# Altium project LESSON-EXAMPLE.PrjPcb
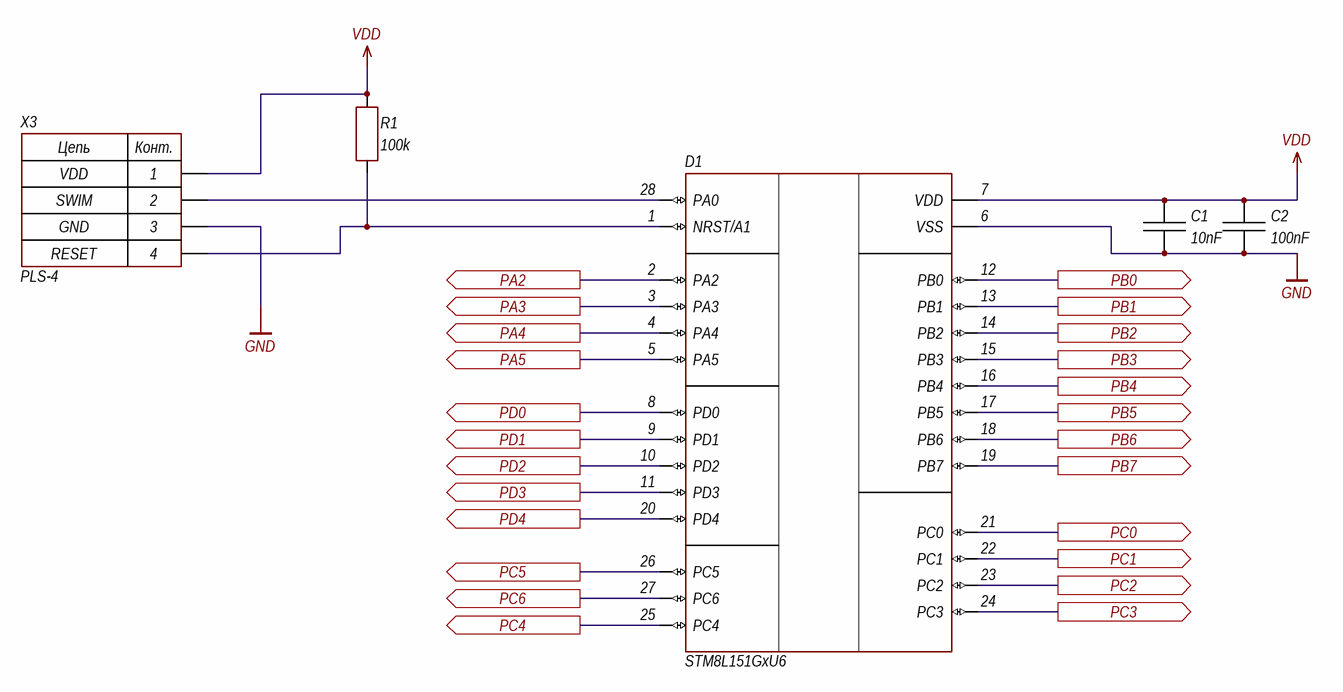
[diagram p0: MainPage.SchDoc]
ProjectVersion: 0.1.2; ProjectNumber: LESSON-EXAMPLE; ProjectDescription2Line: Main board; ProjectDescription: Example project demo; ProjectDateShort: 2021.10; ProjectDate: 23.10.2021; ProjectCompanyName: Azek Clark © 2021; ProjectBoardType: MAINB; ProjectAuthor: Clark A.
2 sheets, 10 parts. Net scope: flat (ports and power ports of the same name join across sheets).
Board file: PCB.PcbDoc
Sheets:
  MainPage.SchDoc
  Connectors.SchDoc

## Sheet MainPage.SchDoc: =ProjectDescription
size 420 x 297 mm; Author: Clark A.; CompanyName: Azek Clark © 2021; Address1: Address1; Address2: Address2; Address3: Address3; Address4: Address4; DocumentNumber: LESSON-EXAMPLE-0.1.2-MAINB Э3; SheetNumber: 1; SheetTotal: 2; Scale: 1:1; Title2str: Main board; DocumentType: Схема электрическая принципиальная; FirstReferrence: LESSON-EXAMPLE

### Parts
C1  10nF  [CH0402C]
C2  100nF  [CH0402C]
D1  STM8L151GxU6  [28-UFQFPN]
R1  100k  [CH0402R]
X3  PLS-4  [CON: PLS-4]

### Ports
PA2 (out), PA3 (out), PA4 (out), PA5 (out), PB0 (out), PB1 (out), PB2 (out), PB3 (out), PB4 (out), PB5 (out), PB6 (out), PB7 (out), PC0 (out), PC1 (out), PC2 (out), PC3 (out), PC4 (out), PC5 (out), PC6 (out), PD0 (out), PD1 (out), PD2 (out), PD3 (out), PD4 (out)

### Nets
GND: C1.1 C2.1 D1.6(VSS) X3.3
VDD: C1.2 C2.2 D1.7(VDD) R1.2 X3.1
PA2: D1.2(PA2) ; port PA2
PA3: D1.3(PA3) ; port PA3
PA4: D1.4(PA4) ; port PA4
PA5: D1.5(PA5) ; port PA5
PB0: D1.12(PB0) ; port PB0
PB1: D1.13(PB1) ; port PB1
PB2: D1.14(PB2) ; port PB2
PB3: D1.15(PB3) ; port PB3
PB4: D1.16(PB4) ; port PB4
PB5: D1.17(PB5) ; port PB5
PB6: D1.18(PB6) ; port PB6
PB7: D1.19(PB7) ; port PB7
PC0: D1.21(PC0) ; port PC0
PC1: D1.22(PC1) ; port PC1
PC2: D1.23(PC2) ; port PC2
PC3: D1.24(PC3) ; port PC3
PC4: D1.25(PC4) ; port PC4
PC5: D1.26(PC5) ; port PC5
PC6: D1.27(PC6) ; port PC6
PD0: D1.8(PD0) ; port PD0
PD1: D1.9(PD1) ; port PD1
PD2: D1.10(PD2) ; port PD2
PD3: D1.11(PD3) ; port PD3
PD4: D1.20(PD4) ; port PD4
NetD1_1: D1.1(NRST/A1) R1.1 X3.4
NetD1_28: D1.28(PA0) X3.2

### Notes on the sheet
- VDD
- SWIM
- GND
- RESET
- Разраб.
- Изм.
- Лист
- № докум.
- Подп.
- Дата
- Лит.
- Масса
- Масштаб
- Пров.
- Т.контр.
- Листов
- Утв.
- Н.контр.
- 2.106-A3
- Копировал
- Формат А3
- (in symbol 4-Connector) Цепь; Конт.

### Library data of the parts
C1 C2 = Capacitor: Manufacturer: *; Model: *; HelpURL: *; ComponentKind: *
  C1: Value: 10nF
  C2: Value: 100nF
D1 = STM8L151GxU6: STM8; Manufacturer: ST Microelectronics; Model: STM8L151GxU6; ComponentKind: UFQFPN28; HelpURL: https://ru.mouser.com/datasheet/2/389/stm8l151c4-956418.pdf
R1 = Resistor: Manufacturer: *; Model: *; HelpURL: *; ComponentKind: *; Value: 100k
X3 = 4-Connector: Model: PLS-4; Manufacturer: *; HelpURL: *; ComponentKind: *

## Sheet Connectors.SchDoc: =ProjectTitle
size 420 x 297 mm; Author: Clark A.; CompanyName: Azek Clark © 2021; Address1: Address1; Address2: Address2; Address3: Address3; Address4: Address4; DocumentNumber: LESSON-EXAMPLE-0.1.2-MAINB Э3; SheetNumber: 2; SheetTotal: 2; Scale: 1:1; DocumentType: Схема электрическая принципиальная; FirstReferrence: LESSON-EXAMPLE
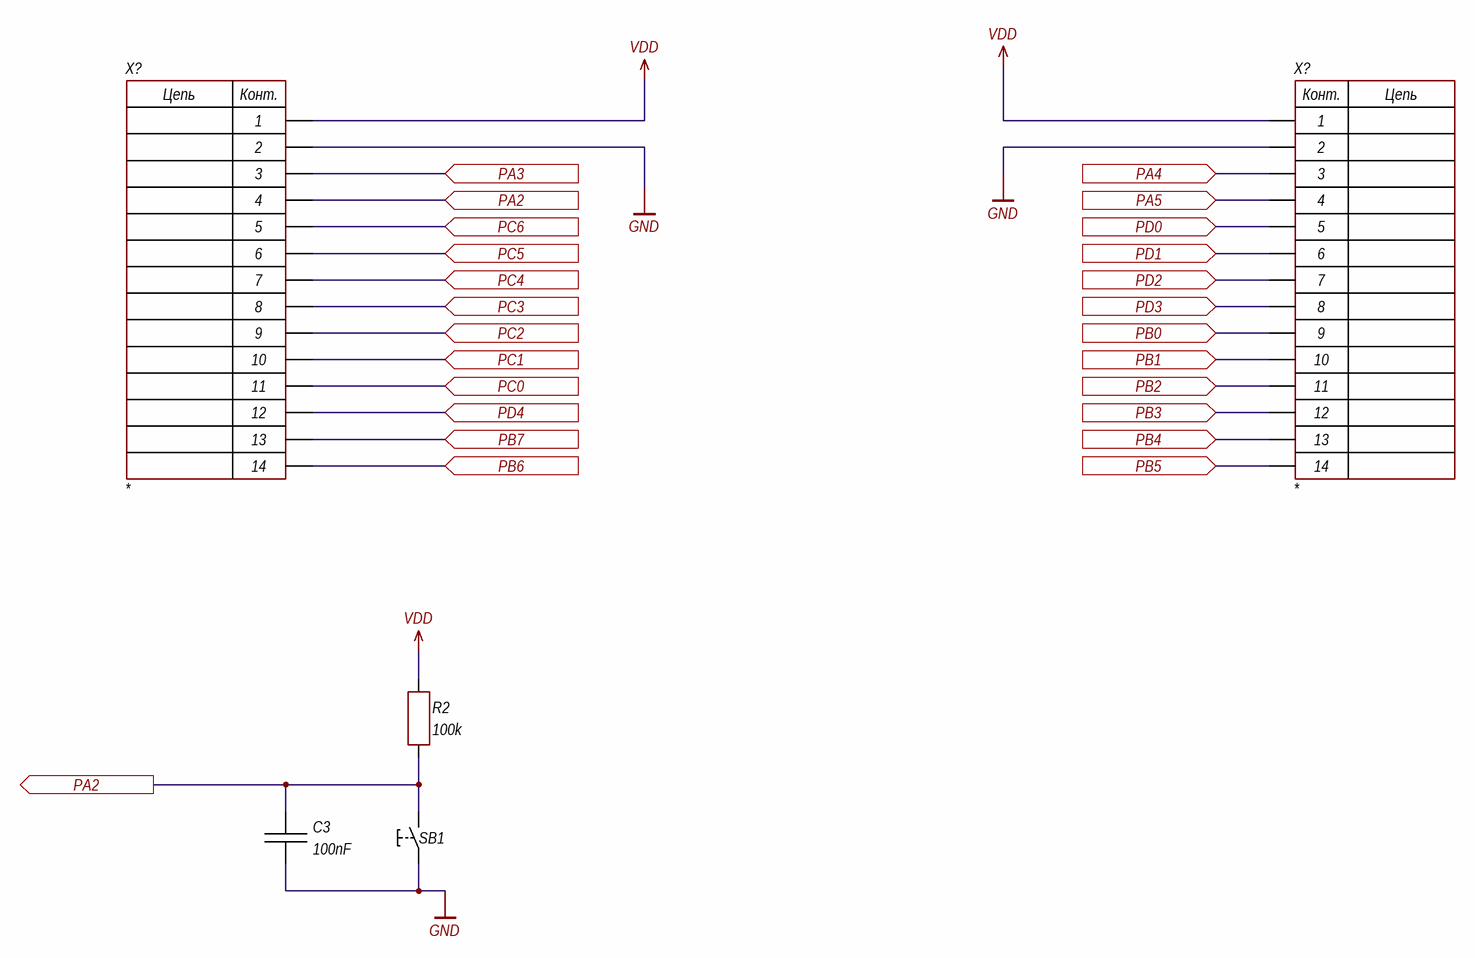
[diagram p1: Connectors.SchDoc]

### Parts
C3  100nF  [CH0402C]
R2  100k  [CH0402R]
SB1  "Кнопка"  [BUT: YTS-A017]  (value not drawn)
X1  *  [CON: PLS-14]
X2  *  [CON: PLS-14]

### Ports
PA2 (in), PA2 (out), PA3 (in), PA4 (in), PA5 (in), PB0 (in), PB1 (in), PB2 (in), PB3 (in), PB4 (in), PB5 (in), PB6 (in), PB7 (in), PC0 (in), PC1 (in), PC2 (in), PC3 (in), PC4 (in), PC5 (in), PC6 (in), PD0 (in), PD1 (in), PD2 (in), PD3 (in), PD4 (in)

### Nets
GND: C3.1 SB1.1 X1.2 X2.2
VDD: R2.2 X1.1 X2.1
PA2: C3.2 R2.1 SB1.2 X1.4 ; port PA2
PA3: X1.3 ; port PA3
PA4: X2.3 ; port PA4
PA5: X2.4 ; port PA5
PB0: X2.9 ; port PB0
PB1: X2.10 ; port PB1
PB2: X2.11 ; port PB2
PB3: X2.12 ; port PB3
PB4: X2.13 ; port PB4
PB5: X2.14 ; port PB5
PB6: X1.14 ; port PB6
PB7: X1.13 ; port PB7
PC0: X1.11 ; port PC0
PC1: X1.10 ; port PC1
PC2: X1.9 ; port PC2
PC3: X1.8 ; port PC3
PC4: X1.7 ; port PC4
PC5: X1.6 ; port PC5
PC6: X1.5 ; port PC6
PD0: X2.5 ; port PD0
PD1: X2.6 ; port PD1
PD2: X2.7 ; port PD2
PD3: X2.8 ; port PD3
PD4: X1.12 ; port PD4

### Notes on the sheet
- Изм.
- Лист
- № докум.
- Подп.
- Дата
- 2.106-A3
- Копировал
- Формат А3
- (in symbol 14-Connector) Конт.; Цепь

### Library data of the parts
C3 = Capacitor: Manufacturer: *; Model: *; HelpURL: *; ComponentKind: *; Value: 100nF
R2 = Resistor: Manufacturer: *; Model: *; HelpURL: *; ComponentKind: *; Value: 100k
SB1 = 1-Button: Button, no latching; Manufacturer: *; Model: *; HelpURL: *; ComponentKind: *
X1 X2 = 14-Connector: Model: *; Manufacturer: *; HelpURL: *; ComponentKind: *

## Nets that join several sheets
GND: MainPage (C1.1 C2.1 D1.6 X3.3), Connectors (C3.1 SB1.1 X1.2 X2.2)
VDD: MainPage (5 pins), Connectors (R2.2 X1.1 X2.1)
PA2: MainPage (D1.2), Connectors (C3.2 R2.1 SB1.2 X1.4)
PA3: MainPage (D1.3), Connectors (X1.3)
PA4: MainPage (D1.4), Connectors (X2.3)
PA5: MainPage (D1.5), Connectors (X2.4)
PB0: MainPage (D1.12), Connectors (X2.9)
PB1: MainPage (D1.13), Connectors (X2.10)
PB2: MainPage (D1.14), Connectors (X2.11)
PB3: MainPage (D1.15), Connectors (X2.12)
PB4: MainPage (D1.16), Connectors (X2.13)
PB5: MainPage (D1.17), Connectors (X2.14)
PB6: MainPage (D1.18), Connectors (X1.14)
PB7: MainPage (D1.19), Connectors (X1.13)
PC0: MainPage (D1.21), Connectors (X1.11)
PC1: MainPage (D1.22), Connectors (X1.10)
PC2: MainPage (D1.23), Connectors (X1.9)
PC3: MainPage (D1.24), Connectors (X1.8)
PC4: MainPage (D1.25), Connectors (X1.7)
PC5: MainPage (D1.26), Connectors (X1.6)
PC6: MainPage (D1.27), Connectors (X1.5)
PD0: MainPage (D1.8), Connectors (X2.5)
PD1: MainPage (D1.9), Connectors (X2.6)
PD2: MainPage (D1.10), Connectors (X2.7)
PD3: MainPage (D1.11), Connectors (X2.8)
PD4: MainPage (D1.20), Connectors (X1.12)